# Altium schematic sheet Notes.SchDoc
size A4; SheetNumber: 7; SheetTotal: 7
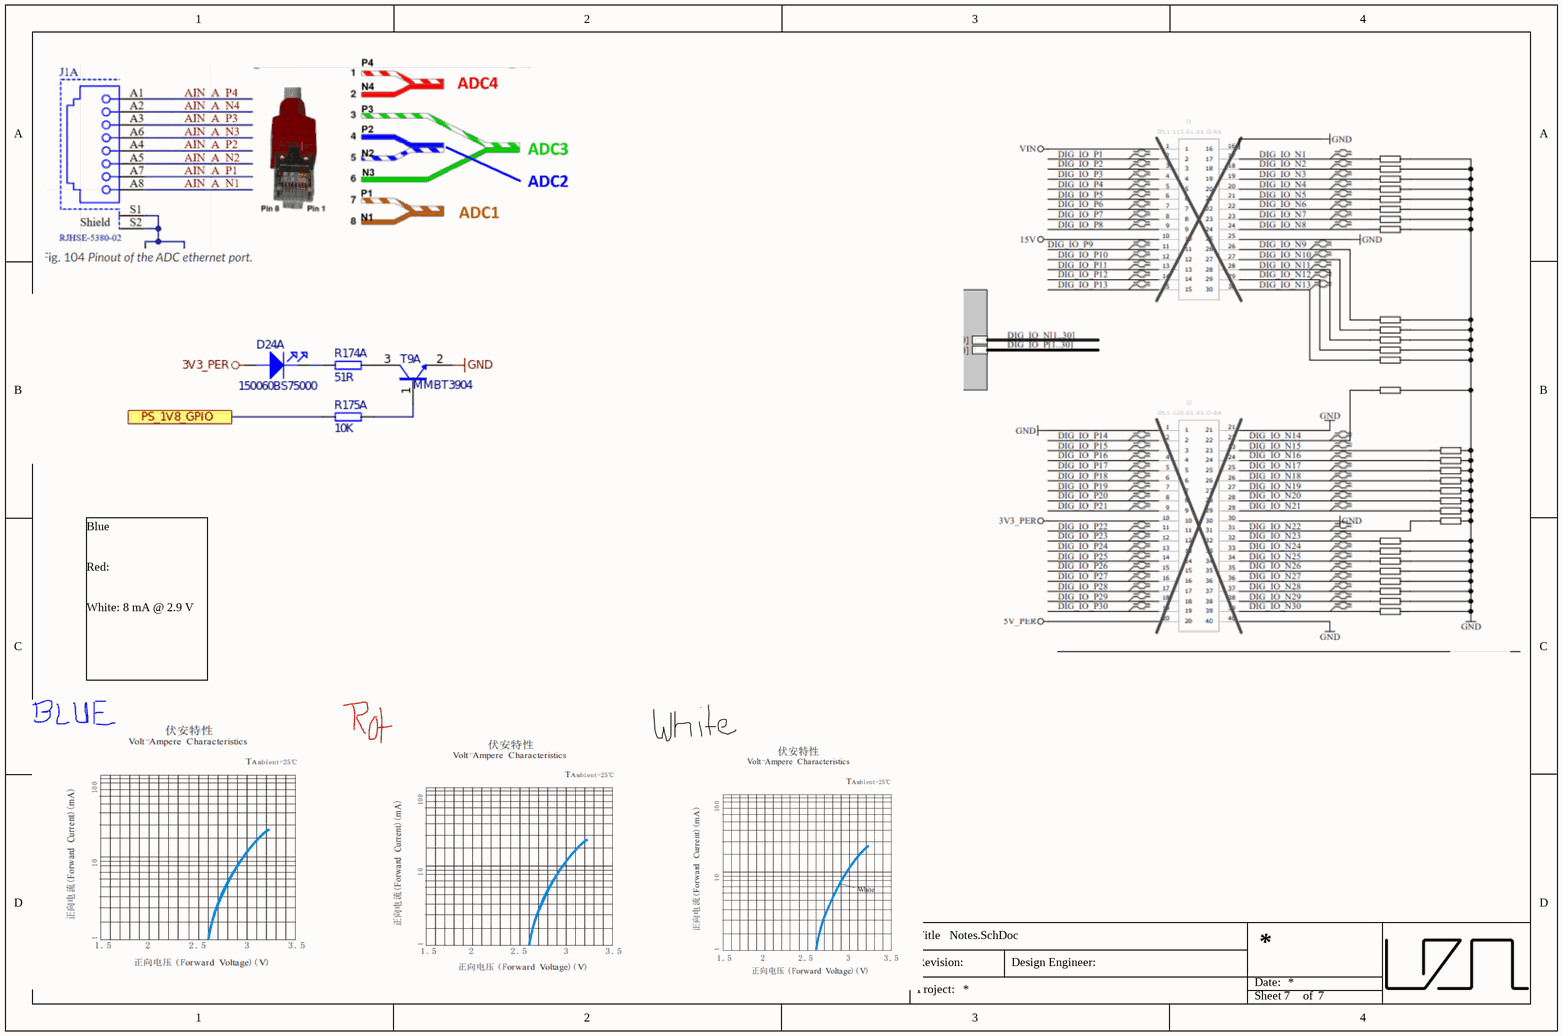
[diagram p0: Notes.SchDoc]

## Notes on the sheet
- Blue
  Red:
  White: 8 mA @ 2.9 V
- Title
- Revision:
- Design Engineer:
- Date:
- Project:
- Sheet
- of